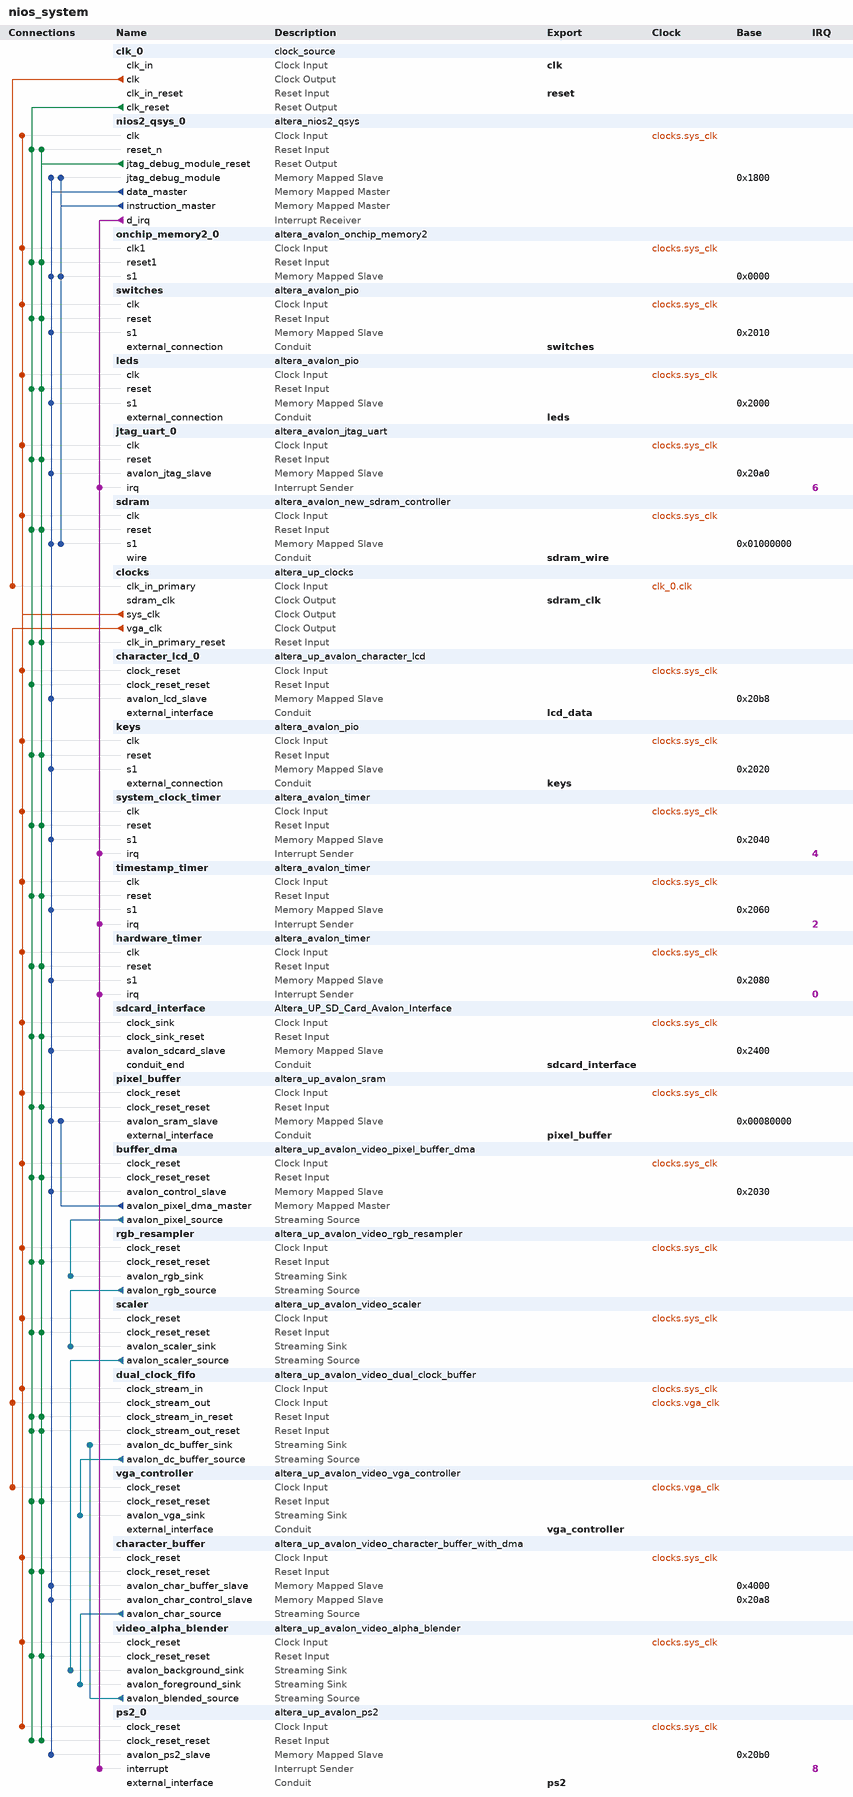
[diagram p0: system contents]
# Platform Designer (Qsys) system nios_system, Cyclone II EP2C35F672C6
# Parameters at their usual value, and those the tool derives, are not listed.
package require -exact qsys 12.0
create_system nios_system
set_project_property DEVICE_FAMILY {Cyclone II}
set_project_property DEVICE EP2C35F672C6

add_instance clk_0 clock_source 12.0
set_instance_parameter_value clk_0 clockFrequency 50000000

add_instance nios2_qsys_0 altera_nios2_qsys 12.0
set_instance_parameter_value nios2_qsys_0 resetSlave sdram.s1
set_instance_parameter_value nios2_qsys_0 exceptionSlave sdram.s1
set_instance_parameter_value nios2_qsys_0 breakSlave nios2_qsys_0.jtag_debug_module
set_instance_parameter_value nios2_qsys_0 impl Fast
set_instance_parameter_value nios2_qsys_0 icache_size 4096

add_instance onchip_memory2_0 altera_avalon_onchip_memory2 12.0
set_instance_parameter_value onchip_memory2_0 dataWidth 32
set_instance_parameter_value onchip_memory2_0 dualPort false
set_instance_parameter_value onchip_memory2_0 initMemContent true
set_instance_parameter_value onchip_memory2_0 initializationFileName onchip_memory2_0
set_instance_parameter_value onchip_memory2_0 memorySize 4096

add_instance switches altera_avalon_pio 12.0
set_instance_parameter_value switches direction Input
set_instance_parameter_value switches width 8

add_instance leds altera_avalon_pio 12.0
set_instance_parameter_value leds direction Output
set_instance_parameter_value leds width 8

add_instance jtag_uart_0 altera_avalon_jtag_uart 12.0
set_instance_parameter_value jtag_uart_0 simInteractiveOptions INTERACTIVE_ASCII_OUTPUT

add_instance sdram altera_avalon_new_sdram_controller 12.0
set_instance_parameter_value sdram TAC 5.5
set_instance_parameter_value sdram TRCD 20.0
set_instance_parameter_value sdram TRP 20.0
set_instance_parameter_value sdram casLatency 3
set_instance_parameter_value sdram columnWidth 8
set_instance_parameter_value sdram dataWidth 16
set_instance_parameter_value sdram generateSimulationModel false
set_instance_parameter_value sdram model custom
set_instance_parameter_value sdram numberOfBanks 4
set_instance_parameter_value sdram numberOfChipSelects 1
set_instance_parameter_value sdram powerUpDelay 100.0
set_instance_parameter_value sdram refreshPeriod 15.625
set_instance_parameter_value sdram rowWidth 12

add_instance clocks altera_up_clocks 12.0
set_instance_parameter_value clocks board DE2
set_instance_parameter_value clocks vga_clk true
set_instance_parameter_value clocks audio_clk false
set_instance_parameter_value clocks audio_clk_freq 12.288

add_instance character_lcd_0 altera_up_avalon_character_lcd 12.0
set_instance_parameter_value character_lcd_0 cursor Normal

add_instance keys altera_avalon_pio 12.0
set_instance_parameter_value keys direction Input
set_instance_parameter_value keys width 4

add_instance system_clock_timer altera_avalon_timer 12.0
set_instance_parameter_value system_clock_timer period 1
set_instance_parameter_value system_clock_timer periodUnits MSEC
set_instance_parameter_value system_clock_timer timerPreset FULL_FEATURED

add_instance timestamp_timer altera_avalon_timer 12.0
set_instance_parameter_value timestamp_timer period 1
set_instance_parameter_value timestamp_timer periodUnits MSEC
set_instance_parameter_value timestamp_timer timerPreset FULL_FEATURED

add_instance hardware_timer altera_avalon_timer 12.0
set_instance_parameter_value hardware_timer period 1
set_instance_parameter_value hardware_timer periodUnits MSEC
set_instance_parameter_value hardware_timer timerPreset FULL_FEATURED

add_instance sdcard_interface Altera_UP_SD_Card_Avalon_Interface 1.0

add_instance pixel_buffer altera_up_avalon_sram 12.0
set_instance_parameter_value pixel_buffer board DE2
set_instance_parameter_value pixel_buffer pixel_buffer true

add_instance buffer_dma altera_up_avalon_video_pixel_buffer_dma 12.0
set_instance_parameter_value buffer_dma addr_mode X-Y
set_instance_parameter_value buffer_dma start_address 0
set_instance_parameter_value buffer_dma back_start_address 0
set_instance_parameter_value buffer_dma image_width 320
set_instance_parameter_value buffer_dma image_height 240
set_instance_parameter_value buffer_dma color_space {16-bit RGB}

add_instance rgb_resampler altera_up_avalon_video_rgb_resampler 12.0
set_instance_parameter_value rgb_resampler input_type {16-bit RGB}
set_instance_parameter_value rgb_resampler output_type {30-bit RGB}
set_instance_parameter_value rgb_resampler alpha 1023

add_instance scaler altera_up_avalon_video_scaler 12.0
set_instance_parameter_value scaler width_scaling 2
set_instance_parameter_value scaler height_scaling 2
set_instance_parameter_value scaler width_in 320
set_instance_parameter_value scaler color_bits 10
set_instance_parameter_value scaler color_planes 3

add_instance dual_clock_fifo altera_up_avalon_video_dual_clock_buffer 12.0
set_instance_parameter_value dual_clock_fifo color_bits 10

add_instance vga_controller altera_up_avalon_video_vga_controller 12.0
set_instance_parameter_value vga_controller board DE2

add_instance character_buffer altera_up_avalon_video_character_buffer_with_dma 12.0
set_instance_parameter_value character_buffer enable_transparency true

add_instance video_alpha_blender altera_up_avalon_video_alpha_blender 12.0

add_instance ps2_0 altera_up_avalon_ps2 12.0

# connections
add_connection clk_0.clk clocks.clk_in_primary clock
add_connection clocks.sys_clk buffer_dma.clock_reset clock
add_connection clocks.sys_clk character_buffer.clock_reset clock
add_connection clocks.sys_clk character_lcd_0.clock_reset clock
add_connection clocks.sys_clk dual_clock_fifo.clock_stream_in clock
add_connection clocks.sys_clk hardware_timer.clk clock
add_connection clocks.sys_clk jtag_uart_0.clk clock
add_connection clocks.sys_clk keys.clk clock
add_connection clocks.sys_clk leds.clk clock
add_connection clocks.sys_clk nios2_qsys_0.clk clock
add_connection clocks.sys_clk onchip_memory2_0.clk1 clock
add_connection clocks.sys_clk pixel_buffer.clock_reset clock
add_connection clocks.sys_clk ps2_0.clock_reset clock
add_connection clocks.sys_clk rgb_resampler.clock_reset clock
add_connection clocks.sys_clk scaler.clock_reset clock
add_connection clocks.sys_clk sdcard_interface.clock_sink clock
add_connection clocks.sys_clk sdram.clk clock
add_connection clocks.sys_clk switches.clk clock
add_connection clocks.sys_clk system_clock_timer.clk clock
add_connection clocks.sys_clk timestamp_timer.clk clock
add_connection clocks.sys_clk video_alpha_blender.clock_reset clock
add_connection clocks.vga_clk dual_clock_fifo.clock_stream_out clock
add_connection clocks.vga_clk vga_controller.clock_reset clock
add_connection clk_0.clk_reset buffer_dma.clock_reset_reset reset
add_connection clk_0.clk_reset character_buffer.clock_reset_reset reset
add_connection clk_0.clk_reset character_lcd_0.clock_reset_reset reset
add_connection clk_0.clk_reset clocks.clk_in_primary_reset reset
add_connection clk_0.clk_reset dual_clock_fifo.clock_stream_in_reset reset
add_connection clk_0.clk_reset dual_clock_fifo.clock_stream_out_reset reset
add_connection clk_0.clk_reset hardware_timer.reset reset
add_connection clk_0.clk_reset jtag_uart_0.reset reset
add_connection clk_0.clk_reset keys.reset reset
add_connection clk_0.clk_reset leds.reset reset
add_connection clk_0.clk_reset nios2_qsys_0.reset_n reset
add_connection clk_0.clk_reset onchip_memory2_0.reset1 reset
add_connection clk_0.clk_reset pixel_buffer.clock_reset_reset reset
add_connection clk_0.clk_reset ps2_0.clock_reset_reset reset
add_connection clk_0.clk_reset rgb_resampler.clock_reset_reset reset
add_connection clk_0.clk_reset scaler.clock_reset_reset reset
add_connection clk_0.clk_reset sdcard_interface.clock_sink_reset reset
add_connection clk_0.clk_reset sdram.reset reset
add_connection clk_0.clk_reset switches.reset reset
add_connection clk_0.clk_reset system_clock_timer.reset reset
add_connection clk_0.clk_reset timestamp_timer.reset reset
add_connection clk_0.clk_reset vga_controller.clock_reset_reset reset
add_connection clk_0.clk_reset video_alpha_blender.clock_reset_reset reset
add_connection nios2_qsys_0.jtag_debug_module_reset buffer_dma.clock_reset_reset reset
add_connection nios2_qsys_0.jtag_debug_module_reset character_buffer.clock_reset_reset reset
add_connection nios2_qsys_0.jtag_debug_module_reset clocks.clk_in_primary_reset reset
add_connection nios2_qsys_0.jtag_debug_module_reset dual_clock_fifo.clock_stream_in_reset reset
add_connection nios2_qsys_0.jtag_debug_module_reset dual_clock_fifo.clock_stream_out_reset reset
add_connection nios2_qsys_0.jtag_debug_module_reset hardware_timer.reset reset
add_connection nios2_qsys_0.jtag_debug_module_reset jtag_uart_0.reset reset
add_connection nios2_qsys_0.jtag_debug_module_reset keys.reset reset
add_connection nios2_qsys_0.jtag_debug_module_reset leds.reset reset
add_connection nios2_qsys_0.jtag_debug_module_reset nios2_qsys_0.reset_n reset
add_connection nios2_qsys_0.jtag_debug_module_reset onchip_memory2_0.reset1 reset
add_connection nios2_qsys_0.jtag_debug_module_reset pixel_buffer.clock_reset_reset reset
add_connection nios2_qsys_0.jtag_debug_module_reset ps2_0.clock_reset_reset reset
add_connection nios2_qsys_0.jtag_debug_module_reset rgb_resampler.clock_reset_reset reset
add_connection nios2_qsys_0.jtag_debug_module_reset scaler.clock_reset_reset reset
add_connection nios2_qsys_0.jtag_debug_module_reset sdcard_interface.clock_sink_reset reset
add_connection nios2_qsys_0.jtag_debug_module_reset sdram.reset reset
add_connection nios2_qsys_0.jtag_debug_module_reset switches.reset reset
add_connection nios2_qsys_0.jtag_debug_module_reset system_clock_timer.reset reset
add_connection nios2_qsys_0.jtag_debug_module_reset timestamp_timer.reset reset
add_connection nios2_qsys_0.jtag_debug_module_reset vga_controller.clock_reset_reset reset
add_connection nios2_qsys_0.jtag_debug_module_reset video_alpha_blender.clock_reset_reset reset
add_connection buffer_dma.avalon_pixel_dma_master pixel_buffer.avalon_sram_slave avalon
set_connection_parameter_value buffer_dma.avalon_pixel_dma_master/pixel_buffer.avalon_sram_slave baseAddress 0x00080000
add_connection nios2_qsys_0.data_master buffer_dma.avalon_control_slave avalon
set_connection_parameter_value nios2_qsys_0.data_master/buffer_dma.avalon_control_slave baseAddress 0x2030
add_connection nios2_qsys_0.data_master character_buffer.avalon_char_buffer_slave avalon
set_connection_parameter_value nios2_qsys_0.data_master/character_buffer.avalon_char_buffer_slave baseAddress 0x4000
add_connection nios2_qsys_0.data_master character_buffer.avalon_char_control_slave avalon
set_connection_parameter_value nios2_qsys_0.data_master/character_buffer.avalon_char_control_slave baseAddress 0x20a8
add_connection nios2_qsys_0.data_master character_lcd_0.avalon_lcd_slave avalon
set_connection_parameter_value nios2_qsys_0.data_master/character_lcd_0.avalon_lcd_slave baseAddress 0x20b8
add_connection nios2_qsys_0.data_master hardware_timer.s1 avalon
set_connection_parameter_value nios2_qsys_0.data_master/hardware_timer.s1 baseAddress 0x2080
add_connection nios2_qsys_0.data_master jtag_uart_0.avalon_jtag_slave avalon
set_connection_parameter_value nios2_qsys_0.data_master/jtag_uart_0.avalon_jtag_slave baseAddress 0x20a0
add_connection nios2_qsys_0.data_master keys.s1 avalon
set_connection_parameter_value nios2_qsys_0.data_master/keys.s1 baseAddress 0x2020
add_connection nios2_qsys_0.data_master leds.s1 avalon
set_connection_parameter_value nios2_qsys_0.data_master/leds.s1 baseAddress 0x2000
add_connection nios2_qsys_0.data_master nios2_qsys_0.jtag_debug_module avalon
set_connection_parameter_value nios2_qsys_0.data_master/nios2_qsys_0.jtag_debug_module baseAddress 0x1800
add_connection nios2_qsys_0.data_master onchip_memory2_0.s1 avalon
set_connection_parameter_value nios2_qsys_0.data_master/onchip_memory2_0.s1 baseAddress 0x0000
add_connection nios2_qsys_0.data_master pixel_buffer.avalon_sram_slave avalon
set_connection_parameter_value nios2_qsys_0.data_master/pixel_buffer.avalon_sram_slave baseAddress 0x00080000
add_connection nios2_qsys_0.data_master ps2_0.avalon_ps2_slave avalon
set_connection_parameter_value nios2_qsys_0.data_master/ps2_0.avalon_ps2_slave baseAddress 0x20b0
add_connection nios2_qsys_0.data_master sdcard_interface.avalon_sdcard_slave avalon
set_connection_parameter_value nios2_qsys_0.data_master/sdcard_interface.avalon_sdcard_slave baseAddress 0x2400
add_connection nios2_qsys_0.data_master sdram.s1 avalon
set_connection_parameter_value nios2_qsys_0.data_master/sdram.s1 baseAddress 0x01000000
add_connection nios2_qsys_0.data_master switches.s1 avalon
set_connection_parameter_value nios2_qsys_0.data_master/switches.s1 baseAddress 0x2010
add_connection nios2_qsys_0.data_master system_clock_timer.s1 avalon
set_connection_parameter_value nios2_qsys_0.data_master/system_clock_timer.s1 baseAddress 0x2040
add_connection nios2_qsys_0.data_master timestamp_timer.s1 avalon
set_connection_parameter_value nios2_qsys_0.data_master/timestamp_timer.s1 baseAddress 0x2060
add_connection nios2_qsys_0.instruction_master nios2_qsys_0.jtag_debug_module avalon
set_connection_parameter_value nios2_qsys_0.instruction_master/nios2_qsys_0.jtag_debug_module baseAddress 0x1800
add_connection nios2_qsys_0.instruction_master onchip_memory2_0.s1 avalon
set_connection_parameter_value nios2_qsys_0.instruction_master/onchip_memory2_0.s1 baseAddress 0x0000
add_connection nios2_qsys_0.instruction_master sdram.s1 avalon
set_connection_parameter_value nios2_qsys_0.instruction_master/sdram.s1 baseAddress 0x01000000
add_connection buffer_dma.avalon_pixel_source rgb_resampler.avalon_rgb_sink avalon_streaming
add_connection character_buffer.avalon_char_source video_alpha_blender.avalon_foreground_sink avalon_streaming
add_connection dual_clock_fifo.avalon_dc_buffer_source vga_controller.avalon_vga_sink avalon_streaming
add_connection rgb_resampler.avalon_rgb_source scaler.avalon_scaler_sink avalon_streaming
add_connection scaler.avalon_scaler_source video_alpha_blender.avalon_background_sink avalon_streaming
add_connection video_alpha_blender.avalon_blended_source dual_clock_fifo.avalon_dc_buffer_sink avalon_streaming
add_connection nios2_qsys_0.d_irq hardware_timer.irq interrupt
set_connection_parameter_value nios2_qsys_0.d_irq/hardware_timer.irq irqNumber 0
add_connection nios2_qsys_0.d_irq jtag_uart_0.irq interrupt
set_connection_parameter_value nios2_qsys_0.d_irq/jtag_uart_0.irq irqNumber 6
add_connection nios2_qsys_0.d_irq ps2_0.interrupt interrupt
set_connection_parameter_value nios2_qsys_0.d_irq/ps2_0.interrupt irqNumber 8
add_connection nios2_qsys_0.d_irq system_clock_timer.irq interrupt
set_connection_parameter_value nios2_qsys_0.d_irq/system_clock_timer.irq irqNumber 4
add_connection nios2_qsys_0.d_irq timestamp_timer.irq interrupt
set_connection_parameter_value nios2_qsys_0.d_irq/timestamp_timer.irq irqNumber 2

# exported interfaces
add_interface clk clock sink
set_interface_property clk EXPORT_OF clk_0.clk_in
add_interface reset reset sink
set_interface_property reset EXPORT_OF clk_0.clk_in_reset
add_interface switches conduit end
set_interface_property switches EXPORT_OF switches.external_connection
add_interface leds conduit end
set_interface_property leds EXPORT_OF leds.external_connection
add_interface sdram_wire conduit end
set_interface_property sdram_wire EXPORT_OF sdram.wire
add_interface lcd_data conduit end
set_interface_property lcd_data EXPORT_OF character_lcd_0.external_interface
add_interface keys conduit end
set_interface_property keys EXPORT_OF keys.external_connection
add_interface sdcard_interface conduit end
set_interface_property sdcard_interface EXPORT_OF sdcard_interface.conduit_end
add_interface pixel_buffer conduit end
set_interface_property pixel_buffer EXPORT_OF pixel_buffer.external_interface
add_interface vga_controller conduit end
set_interface_property vga_controller EXPORT_OF vga_controller.external_interface
add_interface sdram_clk clock source
set_interface_property sdram_clk EXPORT_OF clocks.sdram_clk
add_interface ps2 conduit end
set_interface_property ps2 EXPORT_OF ps2_0.external_interface

save_system nios_system.qsys
